# Altium schematic sheet 6.RK3588_PMUIO2.SchDoc
size A4; SheetNumber: 6; SheetTotal: 21
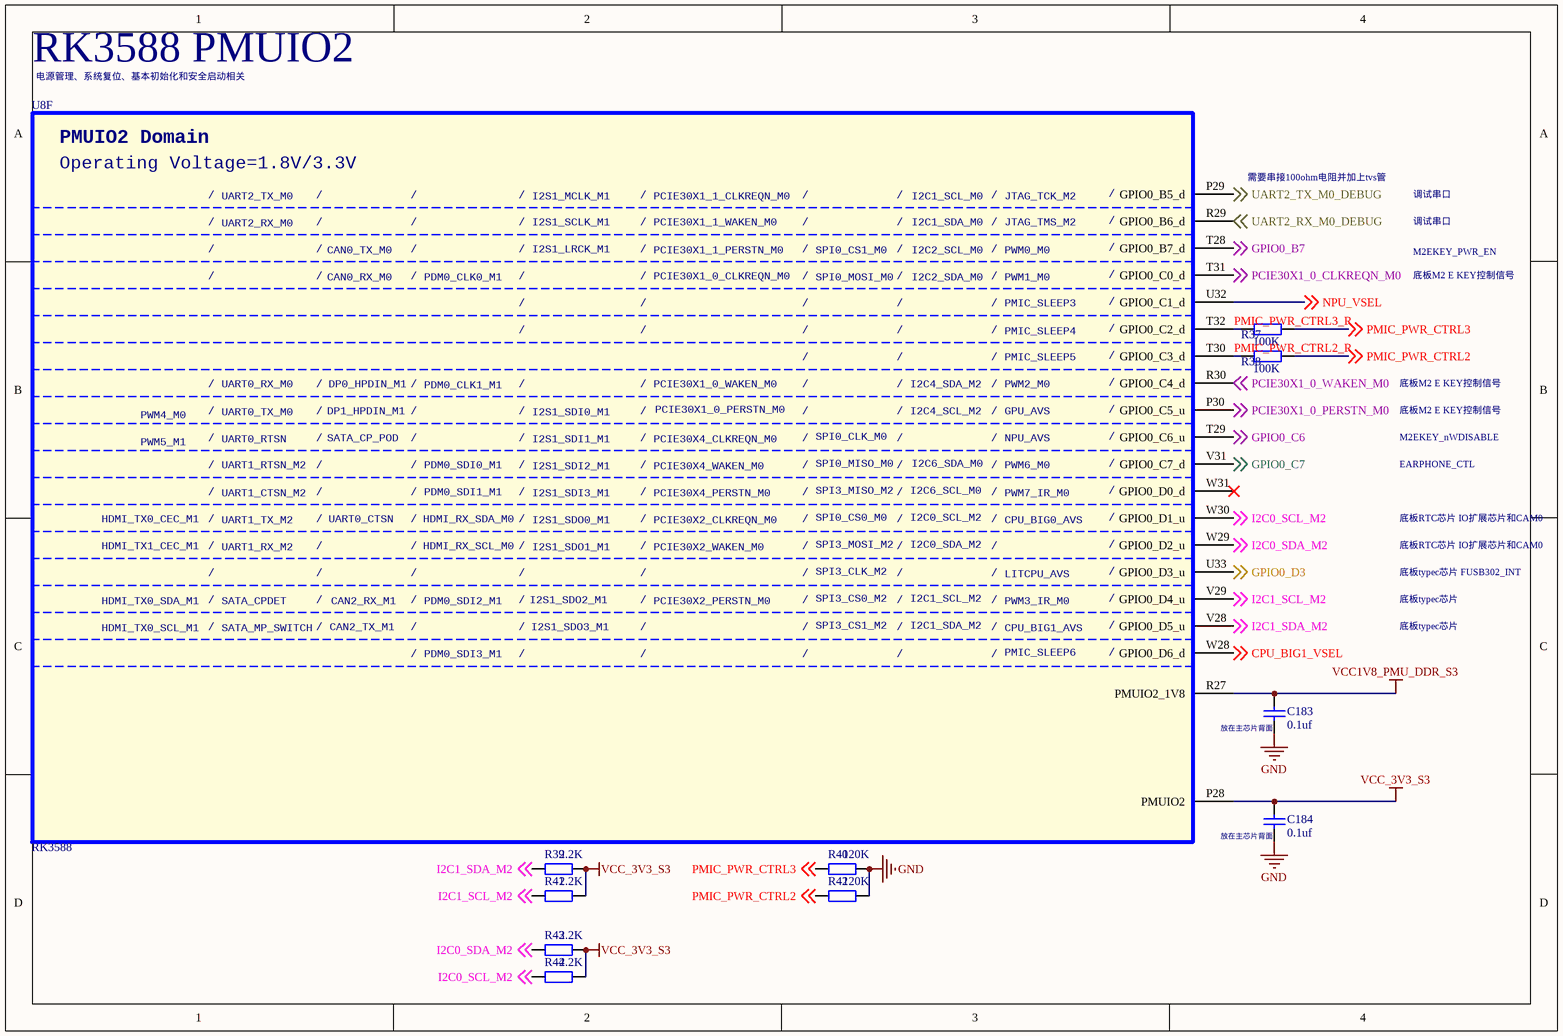
[diagram p0: 6.RK3588_PMUIO2.SchDoc]

## Parts
C183  0.1uf  [C0201_L]
C184  0.1uf  [C0201_L]
R37  100K  [R0201_L]
R38  100K  [R0201_L]
R39  2.2K  [R0201_L]
R40  120K  [R0201_L]
R41  2.2K  [R0201_L]
R42  120K  [R0201_L]
R43  2.2K  [R0201_L]
R44  2.2K  [R0201_L]
U8  RK3588  [BGA1088_23R00X23R00X2R00]  (part F of 26)

## Nets
GND: C183.1 C184.1 R40.1 R42.1
VCC1V8_PMU_DDR_S3: C183.2 U8.R27(PMUIO2_1V8)
VCC_3V3_S3: C184.2 R39.1 R41.1 R43.1 R44.1 U8.P28(PMUIO2)
CPU_BIG1_VSEL: U8.W28(GPIO0_D6_d) ; off-sheet CPU_BIG1_VSEL
GPIO0_B7: U8.T28(GPIO0_B7_d) ; off-sheet GPIO0_B7
GPIO0_C6: U8.T29(GPIO0_C6_u) ; off-sheet GPIO0_C6
GPIO0_C7: U8.V31(GPIO0_C7_d) ; off-sheet GPIO0_C7
GPIO0_D3: U8.U33(GPIO0_D3_u) ; off-sheet GPIO0_D3
I2C0_SCL_M2: R44.2 U8.W30(GPIO0_D1_u) ; off-sheet I2C0_SCL_M2
I2C0_SDA_M2: R43.2 U8.W29(GPIO0_D2_u) ; off-sheet I2C0_SDA_M2
I2C1_SCL_M2: R41.2 U8.V29(GPIO0_D4_u) ; off-sheet I2C1_SCL_M2
I2C1_SDA_M2: R39.2 U8.V28(GPIO0_D5_u) ; off-sheet I2C1_SDA_M2
NPU_VSEL: U8.U32(GPIO0_C1_d) ; off-sheet NPU_VSEL
PCIE30X1_0_CLKREQN_M0: U8.T31(GPIO0_C0_d) ; off-sheet PCIE30X1_0_CLKREQN_M0
PCIE30X1_0_PERSTN_M0: U8.P30(GPIO0_C5_u) ; off-sheet PCIE30X1_0_PERSTN_M0
PCIE30X1_0_WAKEN_M0: U8.R30(GPIO0_C4_d) ; off-sheet PCIE30X1_0_WAKEN_M0
PMIC_PWR_CTRL2: R38.2 R42.2 ; off-sheet PMIC_PWR_CTRL2
PMIC_PWR_CTRL2_R: R38.1 U8.T30(GPIO0_C3_d)
PMIC_PWR_CTRL3: R37.2 R40.2 ; off-sheet PMIC_PWR_CTRL3
PMIC_PWR_CTRL3_R: R37.1 U8.T32(GPIO0_C2_d)
UART2_RX_M0_DEBUG: U8.R29(GPIO0_B6_d) ; off-sheet UART2_RX_M0_DEBUG
UART2_TX_M0_DEBUG: U8.P29(GPIO0_B5_d) ; off-sheet UART2_TX_M0_DEBUG

Not connected (* = marked no-connect by the designer): U8 W31(GPIO0_D0_d)*

## Notes on the sheet
- RK3588 PMUIO2
- 电源管理、系统复位、基本初始化和安全启动相关
- 需要串接100ohm电阻并加上tvs管
- 调试串口
- 底板M2 E KEY控制信号
- M2EKEY_PWR_EN
- M2EKEY_nWDISABLE
- 底板RTC芯片 IO扩展芯片和CAM0
- EARPHONE_CTL
- 底板typec芯片 FUSB302_INT
- 底板typec芯片
- 放在主芯片背面
- (in symbol SOC_RK3588, part F) PMUIO2 Domain; Operating Voltage=1.8V/3.3V; /; UART2_TX_M0; I2S1_MCLK_M1; PCIE30X1_1_CLKREQN_M0; I2C1_SCL_M0; JTAG_TCK_M2; UART2_RX_M0; I2S1_SCLK_M1; PCIE30X1_1_WAKEN_M0; I2C1_SDA_M0; JTAG_TMS_M2; CAN0_TX_M0; I2S1_LRCK_M1; PCIE30X1_1_PERSTN_M0; SPI0_CS1_M0; I2C2_SCL_M0; PWM0_M0; CAN0_RX_M0; PDM0_CLK0_M1; PCIE30X1_0_CLKREQN_M0; SPI0_MOSI_M0; I2C2_SDA_M0; PWM1_M0; PMIC_SLEEP3; PMIC_SLEEP4; PMIC_SLEEP5; UART0_RX_M0; DP0_HPDIN_M1; PDM0_CLK1_M1; PCIE30X1_0_WAKEN_M0; I2C4_SDA_M2; PWM2_M0; UART0_TX_M0; DP1_HPDIN_M1; I2S1_SDI0_M1; PCIE30X1_0_PERSTN_M0; I2C4_SCL_M2; GPU_AVS; PWM4_M0; UART0_RTSN; SATA_CP_POD; I2S1_SDI1_M1; PCIE30X4_CLKREQN_M0; SPI0_CLK_M0; NPU_AVS; PWM5_M1; UART1_RTSN_M2; PDM0_SDI0_M1; I2S1_SDI2_M1; PCIE30X4_WAKEN_M0; SPI0_MISO_M0; I2C6_SDA_M0; PWM6_M0; UART1_CTSN_M2; PDM0_SDI1_M1; I2S1_SDI3_M1; PCIE30X4_PERSTN_M0; SPI3_MISO_M2; I2C6_SCL_M0; PWM7_IR_M0; HDMI_TX0_CEC_M1; UART1_TX_M2; UART0_CTSN; HDMI_RX_SDA_M0; I2S1_SDO0_M1; PCIE30X2_CLKREQN_M0; SPI0_CS0_M0; I2C0_SCL_M2; CPU_BIG0_AVS; HDMI_TX1_CEC_M1; UART1_RX_M2; HDMI_RX_SCL_M0; I2S1_SDO1_M1; PCIE30X2_WAKEN_M0; SPI3_MOSI_M2; I2C0_SDA_M2; SPI3_CLK_M2; LITCPU_AVS; HDMI_TX0_SDA_M1; SATA_CPDET; CAN2_RX_M1; PDM0_SDI2_M1; I2S1_SDO2_M1; PCIE30X2_PERSTN_M0; SPI3_CS0_M2; I2C1_SCL_M2; PWM3_IR_M0; HDMI_TX0_SCL_M1; SATA_MP_SWITCH; CAN2_TX_M1; I2S1_SDO3_M1; SPI3_CS1_M2; I2C1_SDA_M2; CPU_BIG1_AVS; PDM0_SDI3_M1; PMIC_SLEEP6

## Library data of the parts
C183 C184 = C: 贴片电容/MLCC电容
R37-R44 = R: 贴片电阻
U8 = SOC_RK3588: ROCKCHIP SOC